# Altium project PicoPrint.PrjPCB (part 2 of 2)

## Sheet PicoPrint-Main.SchDoc
size A2; DocumentNumber: 5; SheetNumber: 5; SheetTotal: 5; PageSetup: Record=PageOptions|CenterHorizontal=True|CenterVertical=True|PrintScale=0.68|XCorrection=1.00|YCorrection=1.00|PrintKind=1|BorderSize=5000000|LeftOffset=0|BottomOffset=0|Orientation=2|PaperLength=1000|PaperWidth=1000|Scale=100|PaperSource=7|PrintQuality=-4|MediaType=1|DitherType=10|PrintScaleMode=1|PaperKind=A3
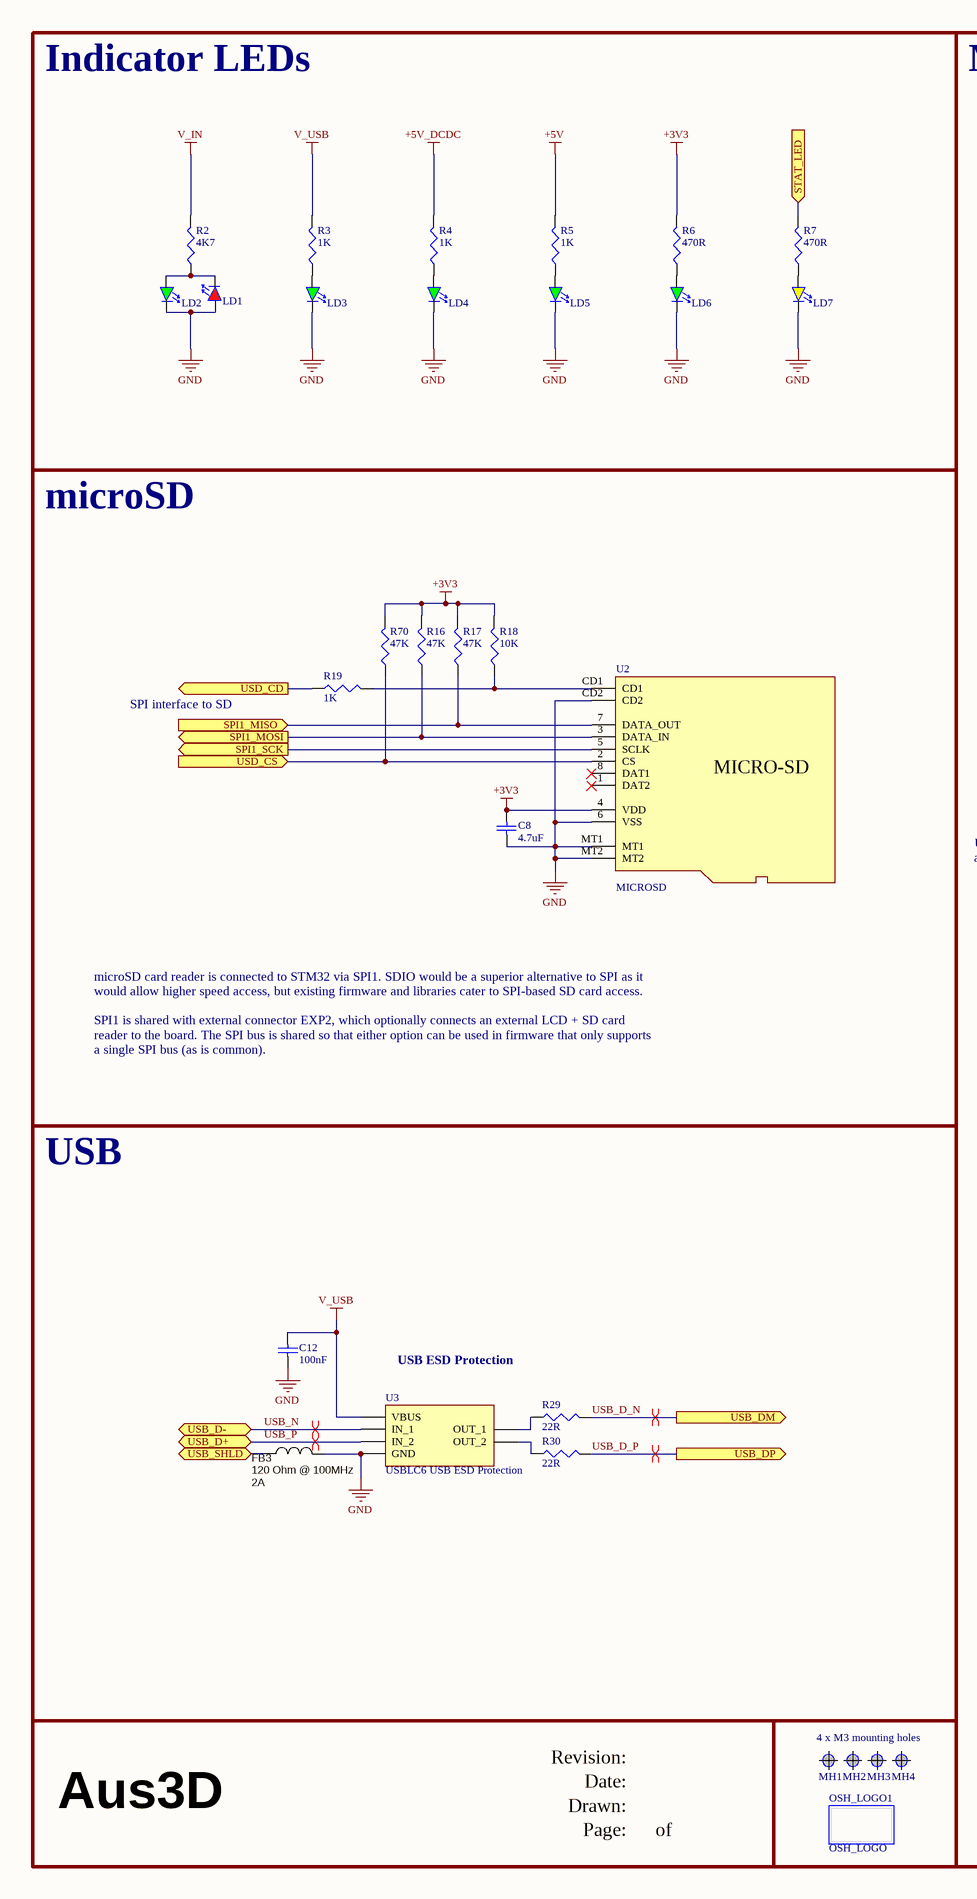
[diagram p5: PicoPrint-Main.SchDoc, left]
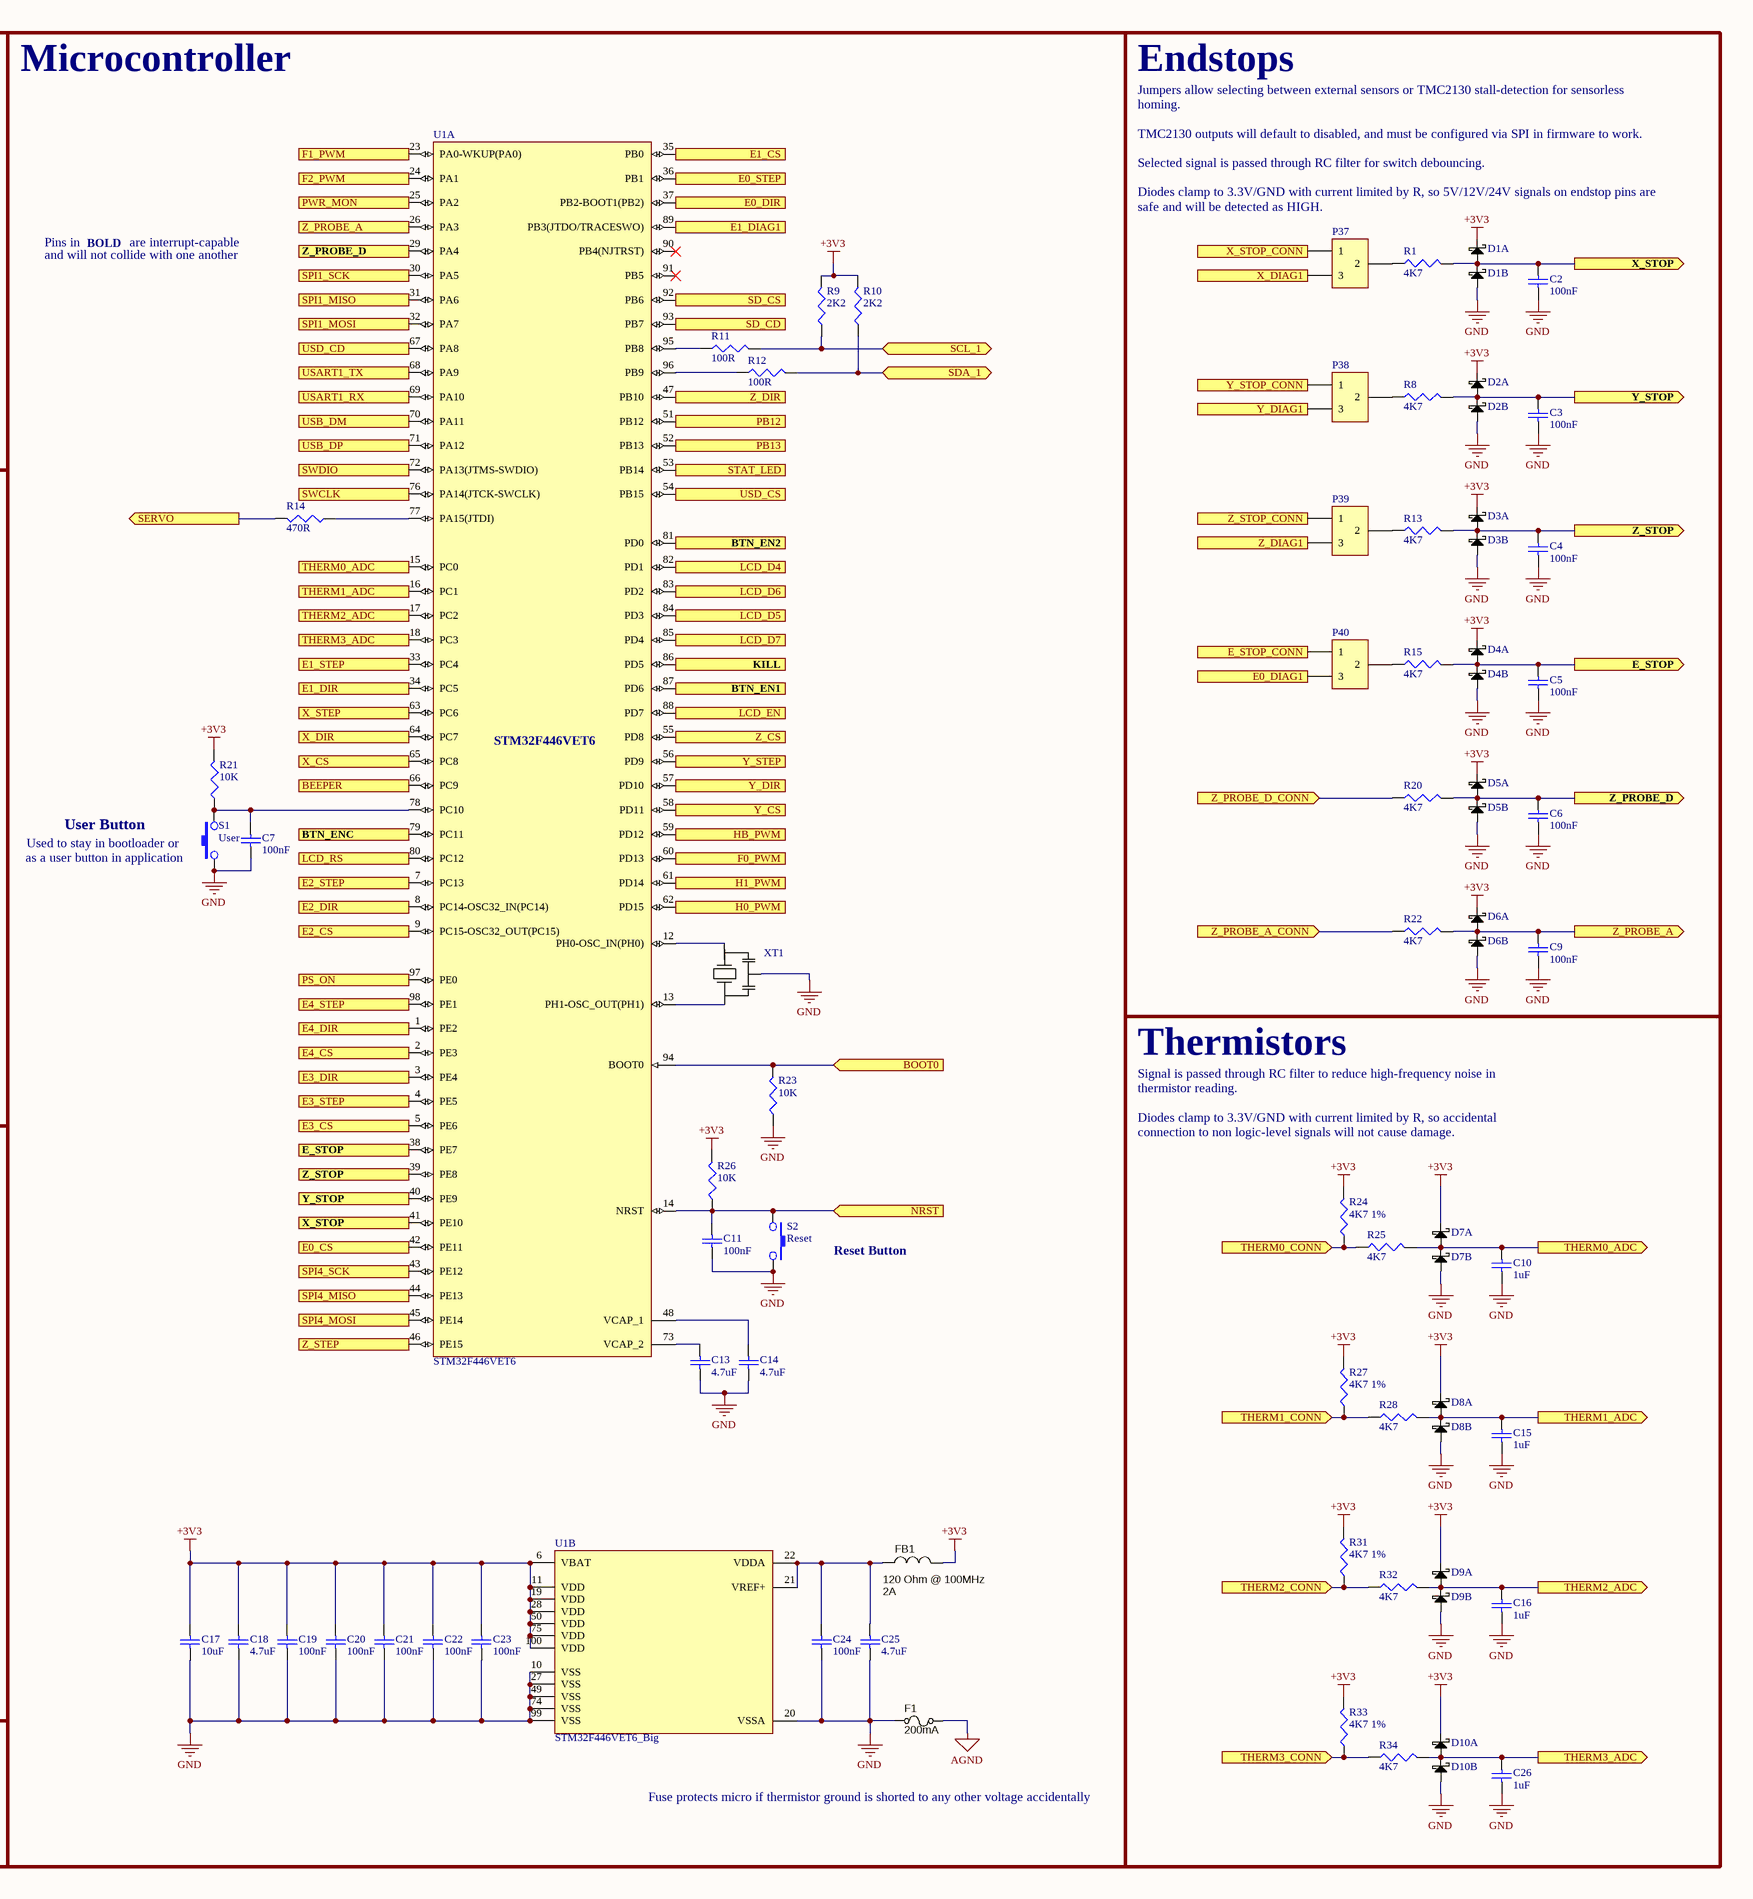
[diagram p6: PicoPrint-Main.SchDoc, right]

### Parts
C2  value 100nF  [CAP 1005-0402]  (hidden comment: CapC-0402-100nF)
C3  value 100nF  [CAP 1005-0402]  (hidden comment: CapC-0402-100nF)
C4  value 100nF  [CAP 1005-0402]  (hidden comment: CapC-0402-100nF)
C5  value 100nF  [CAP 1005-0402]  (hidden comment: CapC-0402-100nF)
C6  value 100nF  [CAP 1005-0402]  (hidden comment: CapC-0402-100nF)
C7  value 100nF  [CAP 1005-0402]  (hidden comment: CapC-0402-100nF)
C8  value 4.7uF  [CAP 1005-0402]  (hidden comment: CapC-0402-4.7uF-10V)
C9  value 100nF  [CAP 1005-0402]  (hidden comment: CapC-0402-100nF)
C10  value 1uF  [CAP 1005-0402]  (hidden comment: CapC-0402-1uF-10V)
C11  value 100nF  [CAP 1005-0402]  (hidden comment: CapC-0402-100nF)
C12  value 100nF  [CAP 1005-0402]  (hidden comment: CapC-0402-100nF)
C13  value 4.7uF  [CAP 1005-0402]  (hidden comment: CapC-0402-4.7uF-10V)
C14  value 4.7uF  [CAP 1005-0402]  (hidden comment: CapC-0402-4.7uF-10V)
C15  value 1uF  [CAP 1005-0402]  (hidden comment: CapC-0402-1uF-10V)
C16  value 1uF  [CAP 1005-0402]  (hidden comment: CapC-0402-1uF-10V)
C17  value 10uF  [CAPC2012X135N]  (hidden comment: CapC-0805-10uF 6.3V)
C18  value 4.7uF  [CAP 1005-0402]  (hidden comment: CapC-0402-4.7uF-10V)
C19  value 100nF  [CAP 1005-0402]  (hidden comment: CapC-0402-100nF)
C20  value 100nF  [CAP 1005-0402]  (hidden comment: CapC-0402-100nF)
C21  value 100nF  [CAP 1005-0402]  (hidden comment: CapC-0402-100nF)
C22  value 100nF  [CAP 1005-0402]  (hidden comment: CapC-0402-100nF)
C23  value 100nF  [CAP 1005-0402]  (hidden comment: CapC-0402-100nF)
C24  value 100nF  [CAP 1005-0402]  (hidden comment: CapC-0402-100nF)
C25  value 4.7uF  [CAP 1005-0402]  (hidden comment: CapC-0402-4.7uF-10V)
C26  value 1uF  [CAP 1005-0402]  (hidden comment: CapC-0402-1uF-10V)
D1  Dual Schottky 100mA 30V SOT523  [SOT523]  (value not drawn)  (parts A,B of 2)
D2  Dual Schottky 100mA 30V SOT523  [SOT523]  (value not drawn)  (parts A,B of 2)
D3  Dual Schottky 100mA 30V SOT523  [SOT523]  (value not drawn)  (parts A,B of 2)
D4  Dual Schottky 100mA 30V SOT523  [SOT523]  (value not drawn)  (parts A,B of 2)
D5  Dual Schottky 100mA 30V SOT523  [SOT523]  (value not drawn)  (parts A,B of 2)
D6  Dual Schottky 100mA 30V SOT523  [SOT523]  (value not drawn)  (parts A,B of 2)
D7  Dual Schottky 100mA 30V SOT523  [SOT523]  (value not drawn)  (parts A,B of 2)
D8  Dual Schottky 100mA 30V SOT523  [SOT523]  (value not drawn)  (parts A,B of 2)
D9  Dual Schottky 100mA 30V SOT523  [SOT523]  (value not drawn)  (parts A,B of 2)
D10  Dual Schottky 100mA 30V SOT523  [SOT523]  (value not drawn)  (parts A,B of 2)
F1  value 200mA  [RES 3216-1206]  (hidden comment: PTC Resettable Fuse)
FB1  Impedance @ Frequency: 120 Ohm @ 100MHz  Current Rating: 2A  [INDC1608N]  (hidden comment: 120R @ 100 MHz)
FB3  Impedance @ Frequency: 120 Ohm @ 100MHz  Current Rating: 2A  [INDC1608N]  (hidden comment: 120R @ 100 MHz)
LD1  LED-0402  [LED 0402]  (value not drawn)
LD2  LED-0402  [LED 0402]  (value not drawn)
LD3  LED-0402  [LED 0402]  (value not drawn)
LD4  LED-0402  [LED 0402]  (value not drawn)
LD5  LED-0402  [LED 0402]  (value not drawn)
LD6  LED-0402  [LED 0402]  (value not drawn)
LD7  LED-0402  [LED 0402]  (value not drawn)
MH1  Screw Hole  [M3-Hole-2]  (value not drawn)  (no BOM)
MH2  Screw Hole  [M3-Hole-2]  (value not drawn)  (no BOM)
MH3  Screw Hole  [M3-Hole-2]  (value not drawn)  (no BOM)
MH4  Screw Hole  [M3-Hole-2]  (value not drawn)  (no BOM)
OSH_LOGO1  OSH_LOGO  [OSHW-LOGO-L]  (no BOM)
P37  X_STOP_SEL  [HDR1X3-HEADER]  (value not drawn)
P38  Y_STOP_SEL  [HDR1X3-HEADER]  (value not drawn)
P39  Z_STOP_SEL  [HDR1X3-HEADER]  (value not drawn)
P40  E_STOP_SEL  [HDR1X3-HEADER]  (value not drawn)
R1  value 4K7  [RESC1005X40N]  (hidden comment: Res-0402-4K7)
R2  value 4K7  [RESC1005X40N]  (hidden comment: Res-0402-4K7)
R3  value 1K  [RESC1005X40N]  (hidden comment: Res-0402-1K)
R4  value 1K  [RESC1005X40N]  (hidden comment: Res-0402-1K)
R5  value 1K  [RESC1005X40N]  (hidden comment: Res-0402-1K)
R6  value 470R  [RESC1005X40N]  (hidden comment: Res-0402-470R)
R7  value 470R  [RESC1005X40N]  (hidden comment: Res-0402-470R)
R8  value 4K7  [RESC1005X40N]  (hidden comment: Res-0402-4K7)
R9  value 2K2  [RESC1005X40N]  (hidden comment: Res-0402-2K2)
R10  value 2K2  [RESC1005X40N]  (hidden comment: Res-0402-2K2)
R11  value 100R  [RESC1005X40N]  (hidden comment: Res-0402-100R)
R12  value 100R  [RESC1005X40N]  (hidden comment: Res-0402-100R)
R13  value 4K7  [RESC1005X40N]  (hidden comment: Res-0402-4K7)
R14  value 470R  [RESC1005X40N]  (hidden comment: Res-0402-470R)
R15  value 4K7  [RESC1005X40N]  (hidden comment: Res-0402-4K7)
R16  value 47K  [RESC1005X40N]  (hidden comment: Res-0402-47K)
R17  value 47K  [RESC1005X40N]  (hidden comment: Res-0402-47K)
R18  value 10K  [RESC1005X40N]  (hidden comment: Res-0402-10K)
R19  value 1K  [RESC1005X40N]  (hidden comment: Res-0402-1K)
R20  value 4K7  [RESC1005X40N]  (hidden comment: Res-0402-4K7)
R21  value 10K  [RESC1005X40N]  (hidden comment: Res-0402-10K)
R22  value 4K7  [RESC1005X40N]  (hidden comment: Res-0402-4K7)
R23  value 10K  [RESC1005X40N]  (hidden comment: Res-0402-10K)
R24  value 4K7 1%  [RESC1005X40N]  (hidden comment: Res-0402-4K7)
R25  value 4K7  [RESC1005X40N]  (hidden comment: Res-0402-4K7)
R26  value 10K  [RESC1005X40N]  (hidden comment: Res-0402-10K)
R27  value 4K7 1%  [RESC1005X40N]  (hidden comment: Res-0402-4K7)
R28  value 4K7  [RESC1005X40N]  (hidden comment: Res-0402-4K7)
R29  value 22R  [RESC1005X40N]  (hidden comment: Res-0402-22R)
R30  value 22R  [RESC1005X40N]  (hidden comment: Res-0402-22R)
R31  value 4K7 1%  [RESC1005X40N]  (hidden comment: Res-0402-4K7)
R32  value 4K7  [RESC1005X40N]  (hidden comment: Res-0402-4K7)
R33  value 4K7 1%  [RESC1005X40N]  (hidden comment: Res-0402-4K7)
R34  value 4K7  [RESC1005X40N]  (hidden comment: Res-0402-4K7)
R70  value 47K  [RESC1005X40N]  (hidden comment: Res-0402-47K)
S1  User  [SW-PB SMD 2pin]
S2  Reset  [SW-PB SMD 2pin]
U1  STM32F446VET6  [STM-LQFP100_N]  (parts A,B of 2)
U2  MICROSD  [MICRO-SD]
U3  USBLC6 USB ESD Protection  [SOT23-6N]
XT1  Ceramic Resonator CSTCE12M0G55-R0  [CERALOCK CSTCE_G]  (value not drawn)

### Blocks framed on the sheet
Indicator LEDs: LD1-LD7 R2-R7
Microcontroller: C7 C11 C13 C14 C17-C25 F1 FB1 R9-R12 R14 R21 R23 R26 S1 S2 U1 XT1
Endstops: C2-C6 C9 D1-D6 P37-P40 R1 R8 R13 R15 R20 R22
microSD: C8 R16-R19 R70 U2
Thermistors: C10 C15 C16 C26 D7-D10 R24 R25 R27 R28 R31-R34
USB: C12 FB3 R29 R30 U3

### Ports
BEEPER (in), BOOT0 (in), BTN_EN1 (in), BTN_EN2 (in), BTN_ENC (in), E0_CS (out), E0_DIAG1 (in), E0_DIR (out), E0_STEP (out), E1_CS (out), E1_DIAG1 (in), E1_DIR (in), E1_STEP (in), E2_CS (in), E2_DIR (in), E2_STEP (in), E3_CS (out), E3_DIR (out), E3_STEP (out), E4_CS (out), E4_DIR (out), E4_STEP (out), E_STOP (in), E_STOP (out), E_STOP_CONN (in), F0_PWM (out), F1_PWM (in), F2_PWM (in), H0_PWM (out), H1_PWM (out), HB_PWM (out), KILL (in), LCD_D4 (out), LCD_D5 (out), LCD_D6 (out), LCD_D7 (out), LCD_EN (out), LCD_RS (in), NRST (in), PB12 (in), PB13 (in), PS_ON (out), PWR_MON (in), SCL_1 (bidir), SD_CD (in), SD_CS (in), SDA_1 (bidir), SERVO (out), SPI1_MISO (in), SPI1_MOSI (out), SPI1_SCK (out), SPI4_MISO (in), SPI4_MOSI (out), SPI4_SCK (out), STAT_LED (in), STAT_LED (out), SWCLK (out), SWDIO (out), THERM0_ADC (in), THERM0_ADC (out), THERM0_CONN (in), THERM1_ADC (in), THERM1_ADC (out), THERM1_CONN (in), THERM2_ADC (in), THERM2_ADC (out), THERM2_CONN (in), THERM3_ADC (in), THERM3_ADC (out), THERM3_CONN (in), USART1_RX (in), USART1_TX (out), USB_D+ (bidir), USB_D- (bidir), USB_DM (out), USB_DP (out), USB_SHLD (bidir), USD_CD (in), USD_CD (out), USD_CS (in), USD_CS (out), X_CS (in), X_DIAG1 (in), X_DIR (in), X_STEP (in), X_STOP (in), X_STOP (out), X_STOP_CONN (in), Y_CS (out), Y_DIAG1 (in), Y_DIR (out), Y_STEP (out), Y_STOP (in), Y_STOP (out), Y_STOP_CONN (in), Z_CS (out), Z_DIAG1 (in), Z_DIR (in), Z_PROBE_A (in), Z_PROBE_A (out), Z_PROBE_A_CONN (in), Z_PROBE_D (in), Z_PROBE_D (out), Z_PROBE_D_CONN (in), Z_STEP (out), Z_STOP (in), Z_STOP (out), Z_STOP_CONN (in)

### Nets
+3V3: C8.2 C17.2 C18.2 C19.2 C20.2 C21.2 C22.2 C23.2 D1.2(K) D2.2(K) D3.2(K) D4.2(K) D5.2(K) D6.2(K) D7.2(K) D8.2(K) D9.2(K) D10.2(K) FB1.2 R6.2 R9.2 R10.2 R16.2 R17.2 R18.2 R21.2 R24.2 R26.2 R27.2 R31.2 R33.2 R70.2 U1.6(VBAT) U1.11(VDD) U1.19(VDD) U1.28(VDD) U1.50(VDD) U1.75(VDD) U1.100(VDD) U2.4(VDD)
+5V: R5.2
+5V_DCDC: R4.2
AGND: F1.2
GND: C2.1 C3.1 C4.1 C5.1 C6.1 C7.1 C8.1 C9.1 C10.1 C11.1 C12.1 C13.1 C14.1 C15.1 C16.1 C17.1 C18.1 C19.1 C20.1 C21.1 C22.1 C23.1 C24.1 C25.1 C26.1 D1.1(A) D2.1(A) D3.1(A) D4.1(A) D5.1(A) D6.1(A) D7.1(A) D8.1(A) D9.1(A) D10.1(A) F1.1 FB3.2 LD1.1(A) LD2.2(K) LD3.2(K) LD4.2(K) LD5.2(K) LD6.2(K) LD7.2(K) R23.1 S1.2 S2.2 U1.10(VSS) U1.20(VSSA) U1.27(VSS) U1.49(VSS) U1.74(VSS) U1.99(VSS) U2.6(VSS) U2.CD2 U2.MT1 U2.MT2 U3.2(GND) XT1.2(GND)
V_IN: R2.2
V_USB: C12.2 R3.2 U3.5(VBUS)
BEEPER: U1.66(PC9) ; port BEEPER
BOOT0: R23.2 U1.94(BOOT0) ; port BOOT0
BTN_EN1: U1.87(PD6) ; port BTN_EN1
BTN_EN2: U1.81(PD0) ; port BTN_EN2
BTN_ENC: U1.79(PC11) ; port BTN_ENC
E0_CS: U1.42(PE11) ; port E0_CS
E0_DIAG1: P40.3 ; port E0_DIAG1
E0_DIR: U1.37(PB2-BOOT1(PB2)) ; port E0_DIR
E0_STEP: U1.36(PB1) ; port E0_STEP
E1_CS: U1.35(PB0) ; port E1_CS
E1_DIAG1: U1.89(PB3(JTDO/TRACESWO)) ; port E1_DIAG1
E1_DIR: U1.34(PC5) ; port E1_DIR
E1_STEP: U1.33(PC4) ; port E1_STEP
E2_CS: U1.9(PC15-OSC32_OUT(PC15)) ; port E2_CS
E2_DIR: U1.8(PC14-OSC32_IN(PC14)) ; port E2_DIR
E2_STEP: U1.7(PC13) ; port E2_STEP
E3_CS: U1.5(PE6) ; port E3_CS
E3_DIR: U1.3(PE4) ; port E3_DIR
E3_STEP: U1.4(PE5) ; port E3_STEP
E4_CS: U1.2(PE3) ; port E4_CS
E4_DIR: U1.1(PE2) ; port E4_DIR
E4_STEP: U1.98(PE1) ; port E4_STEP
E_STOP: C5.2 D4.3(A) R15.2 U1.38(PE7) ; port E_STOP
E_STOP_CONN: P40.1 ; port E_STOP_CONN
F0_PWM: U1.60(PD13) ; port F0_PWM
F1_PWM: U1.23(PA0-WKUP(PA0)) ; port F1_PWM
F2_PWM: U1.24(PA1) ; port F2_PWM
H0_PWM: U1.62(PD15) ; port H0_PWM
H1_PWM: U1.61(PD14) ; port H1_PWM
HB_PWM: U1.59(PD12) ; port HB_PWM
KILL: U1.86(PD5) ; port KILL
LCD_D4: U1.82(PD1) ; port LCD_D4
LCD_D5: U1.84(PD3) ; port LCD_D5
LCD_D6: U1.83(PD2) ; port LCD_D6
LCD_D7: U1.85(PD4) ; port LCD_D7
LCD_EN: U1.88(PD7) ; port LCD_EN
LCD_RS: U1.80(PC12) ; port LCD_RS
NRST: C11.2 R26.1 S2.1 U1.14(NRST) ; port NRST
PB12: U1.51(PB12) ; port PB12
PB13: U1.52(PB13) ; port PB13
PS_ON: U1.97(PE0) ; port PS_ON
PWR_MON: U1.25(PA2) ; port PWR_MON
SCL_1: R9.1 R11.2 ; port SCL_1
SD_CD: U1.93(PB7) ; port SD_CD
SD_CS: U1.92(PB6) ; port SD_CS
SDA_1: R10.1 R12.2 ; port SDA_1
SERVO: R14.2 ; port SERVO
SPI1_MISO: R17.1 U1.31(PA6) U2.7(DATA_OUT) ; port SPI1_MISO
SPI1_MOSI: R16.1 U1.32(PA7) U2.3(DATA_IN) ; port SPI1_MOSI
SPI1_SCK: U1.30(PA5) U2.5(SCLK) ; port SPI1_SCK
SPI4_MISO: U1.44(PE13) ; port SPI4_MISO
SPI4_MOSI: U1.45(PE14) ; port SPI4_MOSI
SPI4_SCK: U1.43(PE12) ; port SPI4_SCK
STAT_LED: R7.2 U1.53(PB14) ; port STAT_LED
SWCLK: U1.76(PA14(JTCK-SWCLK)) ; port SWCLK
SWDIO: U1.72(PA13(JTMS-SWDIO)) ; port SWDIO
THERM0_ADC: C10.2 D7.3(A) R25.2 U1.15(PC0) ; port THERM0_ADC
THERM0_CONN: R24.1 R25.1 ; port THERM0_CONN
THERM1_ADC: C15.2 D8.3(A) R28.2 U1.16(PC1) ; port THERM1_ADC
THERM1_CONN: R27.1 R28.1 ; port THERM1_CONN
THERM2_ADC: C16.2 D9.3(A) R32.2 U1.17(PC2) ; port THERM2_ADC
THERM2_CONN: R31.1 R32.1 ; port THERM2_CONN
THERM3_ADC: C26.2 D10.3(A) R34.2 U1.18(PC3) ; port THERM3_ADC
THERM3_CONN: R33.1 R34.1 ; port THERM3_CONN
USART1_RX: U1.69(PA10) ; port USART1_RX
USART1_TX: U1.68(PA9) ; port USART1_TX
USB_D_N: R29.2 U1.70(PA11) ; port USB_DM
USB_D_P: R30.2 U1.71(PA12) ; port USB_DP
USB_N: U3.1(IN_1) ; port USB_D-
USB_P: U3.3(IN_2) ; port USB_D+
USB_SHLD: FB3.1 ; port USB_SHLD
USD_CD: R19.1 U1.67(PA8) ; port USD_CD
USD_CS: R70.1 U1.54(PB15) U2.2(CS) ; port USD_CS
X_CS: U1.65(PC8) ; port X_CS
X_DIAG1: P37.3 ; port X_DIAG1
X_DIR: U1.64(PC7) ; port X_DIR
X_STEP: U1.63(PC6) ; port X_STEP
X_STOP: C2.2 D1.3(A) R1.2 U1.41(PE10) ; port X_STOP
X_STOP_CONN: P37.1 ; port X_STOP_CONN
Y_CS: U1.58(PD11) ; port Y_CS
Y_DIAG1: P38.3 ; port Y_DIAG1
Y_DIR: U1.57(PD10) ; port Y_DIR
Y_STEP: U1.56(PD9) ; port Y_STEP
Y_STOP: C3.2 D2.3(A) R8.2 U1.40(PE9) ; port Y_STOP
Y_STOP_CONN: P38.1 ; port Y_STOP_CONN
Z_CS: U1.55(PD8) ; port Z_CS
Z_DIAG1: P39.3 ; port Z_DIAG1
Z_DIR: U1.47(PB10) ; port Z_DIR
Z_PROBE_A: C9.2 D6.3(A) R22.2 U1.26(PA3) ; port Z_PROBE_A
Z_PROBE_A_CONN: R22.1 ; port Z_PROBE_A_CONN
Z_PROBE_D: C6.2 D5.3(A) R20.2 U1.29(PA4) ; port Z_PROBE_D
Z_PROBE_D_CONN: R20.1 ; port Z_PROBE_D_CONN
Z_STEP: U1.46(PE15) ; port Z_STEP
Z_STOP: C4.2 D3.3(A) R13.2 U1.39(PE8) ; port Z_STOP
Z_STOP_CONN: P39.1 ; port Z_STOP_CONN
NetC7_2: C7.2 R21.1 S1.1 U1.78(PC10)
NetC13_2: C13.2 U1.73(VCAP_2)
NetC14_2: C14.2 U1.48(VCAP_1)
NetC24_2: C24.2 C25.2 FB1.1 U1.21(VREF+) U1.22(VDDA)
NetLD1_2: LD1.2(K) LD2.1(A) R2.1
NetLD3_1: LD3.1(A) R3.1
NetLD4_1: LD4.1(A) R4.1
NetLD5_1: LD5.1(A) R5.1
NetLD6_1: LD6.1(A) R6.1
NetLD7_1: LD7.1(A) R7.1
NetP37_2: P37.2 R1.1
NetP38_2: P38.2 R8.1
NetP39_2: P39.2 R13.1
NetP40_2: P40.2 R15.1
NetR11_1: R11.1 U1.95(PB8)
NetR12_1: R12.1 U1.96(PB9)
NetR14_1: R14.1 U1.77(PA15(JTDI))
NetR18_1: R18.1 R19.2 U2.CD1
NetR29_1: R29.1 U3.6(OUT_1)
NetR30_1: R30.1 U3.4(OUT_2)
NetU1_12: U1.12(PH0-OSC_IN(PH0)) XT1.3(OUT)
NetU1_13: U1.13(PH1-OSC_OUT(PH1)) XT1.1(IN)

Not connected (* = marked no-connect by the designer): MH1 M3(0); MH2 M3(0); MH3 M3(0); MH4 M3(0); U1 90(PB4(NJTRST))* 91(PB5)*; U2 1(DAT2)* 8(DAT1)*

### Layout directives
differential pair: USB_D_N, USB_D_P, USB_N, USB_P

### Notes on the sheet
- Jumpers allow selecting between external sensors or TMC2130 stall-detection for sensorless homing.
  TMC2130 outputs will default to disabled, and must be configured via SPI in firmware to work.
  Selected signal is passed through RC filter for switch debouncing.
  Diodes clamp to 3.3V/GND with current limited by R, so 5V/12V/24V signals on endstop pins are safe and will be detected as HIGH.
- Pins in
- and will not collide with one another
- BOLD
- are interrupt-capable
- SPI interface to SD
- User Button
- (near S1) Used to stay in bootloader or
  as a user button in application
- microSD card reader is connected to STM32 via SPI1. SDIO would be a superior alternative to SPI as it would allow higher speed access, but existing firmware and libraries cater to SPI-based SD card access.
  SPI1 is shared with external connector EXP2, which optionally connects an external LCD + SD card reader to the board. The SPI bus is shared so that either option can be used in firmware that only supports a single SPI bus (as is common).
- Signal is passed through RC filter to reduce high-frequency noise in thermistor reading.
  Diodes clamp to 3.3V/GND with current limited by R, so accidental connection to non logic-level signals will not cause damage.
- Reset Button
- USB ESD Protection
- 4 x M3 mounting holes
- Date:
- Revision:
- Fuse protects micro if thermistor ground is shorted to any other voltage accidentally
- Aus3D
- Drawn:
- Page:
- of
- (in symbol MICROSD) MICRO-SD

### Library data of the parts
C2-C7 C9 C11 C12 C19-C24 = CapC-0402-100nF: Capacitor (SMD Ceramic); Note: Approved sub OK; Published: 8-Jun-2000; Revision: July-2002: Re-released for DXP Platform.; Publisher: Altium Limited; Supplier 1: Digi-Key; Supplier Part Number 1: 311-1336-1-ND
C8 C13 C14 C18 C25 = CapC-0402-4.7uF-10V: Capacitor (SMD Ceramic); Voltage: 10V; Note: Approved sub OK; Published: 8-Jun-2000; Revision: July-2002: Re-released for DXP Platform.; Publisher: Altium Limited; Supplier 1: Digi-Key; Supplier Part Number 1: 1276-1482-1-ND
C10 C15 C16 C26 = CapC-0402-1uF-10V: Capacitor (SMD Ceramic); Voltage: 10V; Note: Approved sub OK; Published: 8-Jun-2000; Revision: July-2002: Re-released for DXP Platform.; Publisher: Altium Limited; Supplier 1: Digi-Key; Supplier Part Number 1: 1276-1448-1-ND
C17 = CapC-0805-10uF 6.3V: Capacitor (SMD Ceramic); Note: Approved sub OK; Published: 8-Jun-2000; Revision: July-2002: Re-released for DXP Platform.; Publisher: Altium Limited; Supplier 1: Digi-Key; Supplier Part Number 1: 1276-6457-1-ND
D1-D10 = Diode Schottky BAT54ST: Diode (SMD); Note: Approved sub OK; Revision: July-2002: Re-released for DXP Platform.; Supplier 1: Digi-Key; Supplier Part Number 1: BAT54ST-TPCT-ND
F1 = Fuse - 30V 400mA Trip PTC SMD 1206: Note: Approved sub OK; Package / Case: 1206 (3216 metric); Supplier 1: Digi-Key; Supplier Part Number 1: 507-1797-1-ND
FB1 = FERRITE_120R-100MHz_0603: Ferrite bead 120 Ohm at 100 MHz 2A 0603 SMD; Manufacturer 1: Murata Electronics North America; Manufacturer Part Number 1: BLM18PG121SN1D; Current: 900mA; DC Resistance (DCR): 172.9 mOhm Max; Frequency - Self Resonant: 23MHz; Frequency - Test: 100kHz; Filter Type: Differential Mode - Single; Number of Lines: 1; Ratings: 2 A; 50 mO DC; SCDType: source; Note: Approved sub OK; Current - Saturation: 900mA; Current - Temperature Rise: 900mA; Applications: Power Supplies; Package / Case: 1210 (3225 Metric); Operating Temperature: -40°C ~ 105°C; ComponentLink1URL: http://www.yuden.co.jp/ut/product/pdf/wound02_e.pdf; ComponentLink1Description: http://www.yuden.co.jp/ut/product/pdf/wound02_e.pdf; Supplier 1: Digi-Key; Supplier Part Number 1: 490-1037-1-ND; Mounting Type: Surface Mount; Height (Max): 0.037" (0.95mm); Size / Dimension: 0.063" L x 0.031" W (1.60mm x 0.80mm); ComponentLink2URL: http://search.murata.co.jp/Ceramy/image/img/PDF/ENG/L0110S0100BLM18P.pdf; ComponentLink2Description: http://search.murata.co.jp/Ceramy/image/img/PDF/ENG/L0110S0100BLM18P.pdf; Value: 120R @ 100 MHz
FB3 = FERRITE_120R-100MHz_0603: Ferrite bead 120 Ohm at 100 MHz 2A 0603 SMD; Manufacturer 1: Murata Electronics North America; Manufacturer Part Number 1: BLM18PG121SN1D; Current: 900mA; DC Resistance (DCR): 172.9 mOhm Max; Frequency - Self Resonant: 23MHz; Frequency - Test: 100kHz; Filter Type: Differential Mode - Single; Number of Lines: 1; Ratings: 2 A; 50 mO DC; SCDType: source; Current - Saturation: 900mA; Current - Temperature Rise: 900mA; Applications: Power Supplies; Package / Case: 1210 (3225 Metric); Operating Temperature: -40°C ~ 105°C; ComponentLink1URL: http://www.yuden.co.jp/ut/product/pdf/wound02_e.pdf; ComponentLink1Description: http://www.yuden.co.jp/ut/product/pdf/wound02_e.pdf; Supplier 1: Digi-Key; Supplier Part Number 1: 490-1037-1-ND; Mounting Type: Surface Mount; Height (Max): 0.037" (0.95mm); Size / Dimension: 0.063" L x 0.031" W (1.60mm x 0.80mm); ComponentLink2URL: http://search.murata.co.jp/Ceramy/image/img/PDF/ENG/L0110S0100BLM18P.pdf; ComponentLink2Description: http://search.murata.co.jp/Ceramy/image/img/PDF/ENG/L0110S0100BLM18P.pdf; Value: 120R @ 100 MHz
LD1 = LEDR  0402: LED (SMD); Note: Approved sub OK; Value: Red; Supplier 1: Digi-Key; Supplier Part Number 1: 732-11991-1-ND
LD2-LD6 = LEDG  0402: LED (SMD); Note: Approved sub OK; Value: Green; Supplier 1: Digi-Key; Supplier Part Number 1: 732-11992-1-ND
LD7 = LEDY  0402: LED (SMD); Note: Approved sub OK; Value: Yellow; Supplier 1: Digi-Key; Supplier Part Number 1: 732-11993-1-ND
P37-P40 = Header 3: Header, 3-Pin; Manufacturer 1: Generic Header; Note: Approved sub OK; LatestRevisionDate: 17-Jul-2002; LatestRevisionNote: Re-released for DXP Platform.; Publisher: Altium Limited
R1 R2 R8 R13 R15 R20 R22 R24 R25 R27 R28 R31-R34 = Res-0402-4K7: Resistor; Note: Approved sub OK; Published: 8-Jun-2000; Revision: July-2002: Re-released for DXP Platform.; Publisher: Altium Limited; Supplier 1: Digi-Key; Supplier Part Number 1: 311-4.7KJRCT-ND
R3-R5 R19 = Res-0402-1K: Resistor; Note: Approved sub OK; Published: 8-Jun-2000; Revision: July-2002: Re-released for DXP Platform.; Publisher: Altium Limited; Supplier 1: Digi-Key; Supplier Part Number 1: 311-1.0KJRCT-ND
R6 R7 R14 = Res-0402-470R: Resistor; Note: Approved sub OK; Published: 8-Jun-2000; Revision: July-2002: Re-released for DXP Platform.; Publisher: Altium Limited; Supplier 1: Digi-Key; Supplier Part Number 1: 311-470JRCT-ND
R9 R10 = Res-0402-2K2: Resistor; Note: Approved sub OK; Published: 8-Jun-2000; Revision: July-2002: Re-released for DXP Platform.; Publisher: Altium Limited; Supplier 1: Digi-Key; Supplier Part Number 1: 311-2.2KJRCT-ND
R11 R12 = Res-0402-100R: Resistor; Note: Approved sub OK; Published: 8-Jun-2000; Revision: July-2002: Re-released for DXP Platform.; Publisher: Altium Limited; Supplier 1: Digi-Key; Supplier Part Number 1: 311-100JRCT-ND
R16 R17 R70 = Res-0402-47K: Resistor; Note: Approved sub OK; Published: 8-Jun-2000; Revision: July-2002: Re-released for DXP Platform.; Publisher: Altium Limited; Supplier 1: Digi-Key; Supplier Part Number 1: 311-47KJRCT-ND
R18 R21 R23 R26 = Res-0402-10K: Resistor; Note: Approved sub OK; Published: 8-Jun-2000; Revision: July-2002: Re-released for DXP Platform.; Publisher: Altium Limited; Supplier 1: Digi-Key; Supplier Part Number 1: 311-10KJRCT-ND
R29 R30 = Res-0402-22R: Resistor; Note: Approved sub OK; Published: 8-Jun-2000; Revision: July-2002: Re-released for DXP Platform.; Publisher: Altium Limited; Supplier 1: Digi-Key; Supplier Part Number 1: 311-22JRCT-ND
S1 S2 = SW-PB: SMD Button; Note: Approved sub OK; Supplier 1: Digi-Key; Supplier Part Number 1: 679-2396-1-ND
U1 = STM32F446VET6_Big: ARM Cortex-M4 32-bit MCU+FPU, 210 DMIPS, 512 kB Flash, 128 kB Internal RAM, 81 I/Os, 100-pin LQFP, -40 to 105 degC, Tray; Manufacturer: STMicroelectronics; PartNumber: STM32F407VGT7; D/A Converter: 2x12-bit; FLASH Size (Prog) (kB): 1024; I/Os (High Current): 82; Internal RAM Size (kB): 192; Operating Frequency(F) (Processor speed) (MHz): 168; Supply Voltage(Vcc) max (V): 3.6; Supply Voltage(Vcc) min (V): 1.8; DatasheetVersion: Rev. 4; PackageVersion: Rev. 1, 06/2013; PackageReference: LQFP100; PackageDescription: 100-Pin Low Profile Quad Flat Package, 14 x 14 mm Body, 0.5 mm Pitch; Core: ARM Cortex-M4; Packing: Tray; Mounting Technology: Surface Mount; ComponentLink1Description: Manufacturer URL; ComponentLink1URL: http://www.st.com/web/en/home.html; ComponentLink2Description: Datasheet; ComponentLink2URL: http://www.st.com/st-web-ui/static/active/en/resource/technical/document/datasheet/DM00037051.pdf; ComponentLink3Description: Package Specification; ComponentLink3URL: http://www.st.com/st-web-ui/static/active/en/resource/technical/document/data_brief/DM00071938.pdf; Supplier 1: Digi-Key; Supplier Part Number 1: 497-15375-ND
U2 = MICROSD: MicroSD Card Socket; Note: Approved sub OK; Supplier 1: Digi-Key; Supplier Part Number 1: 101-00660-68-6-1-ND
U3 = USBLC6 USB ESD Protection: ESD Protection IC; Supplier 1: Digi-Key; Supplier Part Number 1: 497-5235-1-ND
XT1 = Ceramic Resonator CSTCE12M0G55-R0: Ceramic Resonator; Note: Approved sub OK; Supplier 1: Digi-Key; Supplier Part Number 1: 490-1197-1-ND

## Nets that join several sheets
+3V3: PicoPrint-Connectors (J2.1 P7.5 P18.13), PicoPrint-Power (C116.1 C123.2 J8.1 U11.5), PicoPrint-Motors (10 pins), PicoPrint-Main (40 pins)
+5V: PicoPrint-Connectors (11 pins), PicoPrint-Power (6 pins), PicoPrint-MOSFETs (C27.1 U4.1), PicoPrint-Motors (10 pins), PicoPrint-Main (R5.2)
+5V_DCDC: PicoPrint-Power (5 pins), PicoPrint-Main (R4.2)
+ES_VDD: PicoPrint-Connectors (5 pins), PicoPrint-Power (J8.2)
AGND: PicoPrint-Connectors (P14.2 P14.4 P14.6 P14.8), PicoPrint-Main (F1.2)
GND: PicoPrint-Connectors (21 pins), PicoPrint-Power (20 pins), PicoPrint-MOSFETs (21 pins), PicoPrint-Motors (124 pins), PicoPrint-Main (59 pins)
HB_GND: PicoPrint-Connectors (P4.1), PicoPrint-MOSFETs (Q5.3)
V_IN: PicoPrint-Connectors (P1.2), PicoPrint-Power (5 pins), PicoPrint-Main (R2.2)
V_MAIN: PicoPrint-Connectors (11 pins), PicoPrint-Power (9 pins), PicoPrint-MOSFETs (D11.K D12.K D13.K)
V_MOT: PicoPrint-Power (FB2.2), PicoPrint-Motors (44 pins)
V_USB: PicoPrint-Connectors (J1.VBUS), PicoPrint-Power (F3.1), PicoPrint-Main (C12.2 R3.2 U3.5)
BEEPER: PicoPrint-Connectors (P5.1), PicoPrint-Main (U1.66)
BOOT0: PicoPrint-Connectors (P18.11), PicoPrint-Main (R23.2 U1.94)
BTN_EN1: PicoPrint-Connectors (P10.5), PicoPrint-Main (U1.87)
BTN_EN2: PicoPrint-Connectors (P10.3), PicoPrint-Main (U1.81)
BTN_ENC: PicoPrint-Connectors (P5.2), PicoPrint-Main (U1.79)
E0_CS: PicoPrint-Connectors (P34.3), PicoPrint-Motors (U8.2), PicoPrint-Main (U1.42)
E0_DIAG1: PicoPrint-Motors (U8.21), PicoPrint-Main (P40.3)
E0_DIR: PicoPrint-Connectors (P34.1), PicoPrint-Motors (U8.7), PicoPrint-Main (U1.37)
E0_MOT_1A: PicoPrint-Connectors (P33.3 P33.4), PicoPrint-Motors (C98.2 U8.32)
E0_MOT_1B: PicoPrint-Connectors (P33.1 P33.2), PicoPrint-Motors (C97.2 U8.34)
E0_MOT_2A: PicoPrint-Connectors (P33.5 P33.6), PicoPrint-Motors (C104.1 U8.13)
E0_MOT_2B: PicoPrint-Connectors (P33.7 P33.8), PicoPrint-Motors (C103.1 U8.15)
E0_STEP: PicoPrint-Connectors (P34.2), PicoPrint-Motors (U8.6), PicoPrint-Main (U1.36)
E1_CS: PicoPrint-Connectors (P36.3), PicoPrint-Motors (U9.2), PicoPrint-Main (U1.35)
E1_DIAG1: PicoPrint-Motors (U9.21), PicoPrint-Main (U1.89)
E1_DIR: PicoPrint-Connectors (P36.1), PicoPrint-Motors (U9.7), PicoPrint-Main (U1.34)
E1_MOT_1A: PicoPrint-Connectors (P35.3 P35.4), PicoPrint-Motors (C100.2 U9.32)
E1_MOT_1B: PicoPrint-Connectors (P35.1 P35.2), PicoPrint-Motors (C99.2 U9.34)
E1_MOT_2A: PicoPrint-Connectors (P35.5 P35.6), PicoPrint-Motors (C106.1 U9.13)
E1_MOT_2B: PicoPrint-Connectors (P35.7 P35.8), PicoPrint-Motors (C105.1 U9.15)
E1_STEP: PicoPrint-Connectors (P36.2), PicoPrint-Motors (U9.6), PicoPrint-Main (U1.33)
E2_CS: PicoPrint-Connectors (P13.8), PicoPrint-Main (U1.9)
E2_DIR: PicoPrint-Connectors (P13.6), PicoPrint-Main (U1.8)
E2_STEP: PicoPrint-Connectors (P13.4), PicoPrint-Main (U1.7)
E3_CS: PicoPrint-Connectors (P13.13), PicoPrint-Main (U1.5)
E3_DIR: PicoPrint-Connectors (P13.11), PicoPrint-Main (U1.3)
E3_STEP: PicoPrint-Connectors (P13.9), PicoPrint-Main (U1.4)
E4_CS: PicoPrint-Connectors (P13.14), PicoPrint-Main (U1.2)
E4_DIR: PicoPrint-Connectors (P13.12), PicoPrint-Main (U1.1)
E4_STEP: PicoPrint-Connectors (P13.10), PicoPrint-Main (U1.98)
E_STOP_CONN: PicoPrint-Connectors (P3.3), PicoPrint-Main (P40.1)
F0_PWM: PicoPrint-MOSFETs (R35.1 R37.2 R39.2), PicoPrint-Main (U1.60)
F1_PWM: PicoPrint-MOSFETs (R42.1 R44.2 R46.2), PicoPrint-Main (U1.23)
F2_PWM: PicoPrint-MOSFETs (R47.1 R48.2 R49.2), PicoPrint-Main (U1.24)
FAN0: PicoPrint-Connectors (P19.2 P22.2), PicoPrint-MOSFETs (D11.A Q1.3)
FAN1: PicoPrint-Connectors (P24.2 P26.2), PicoPrint-MOSFETs (D12.A Q4.3)
FAN2: PicoPrint-Connectors (P32.2), PicoPrint-MOSFETs (D13.A Q8.3)
H0_PWM: PicoPrint-MOSFETs (R36.1 R38.2 R40.2), PicoPrint-Main (U1.62)
H1_PWM: PicoPrint-MOSFETs (R41.1 R43.2 R45.2), PicoPrint-Main (U1.61)
HB_PWM: PicoPrint-MOSFETs (R51.2 R52.2 U4.2), PicoPrint-Main (U1.59)
HEATED_BED: PicoPrint-Connectors (P11.1), PicoPrint-MOSFETs (Q5.2)
HEATER0: PicoPrint-Connectors (P12.2 P15.2), PicoPrint-MOSFETs (Q2.3)
HEATER1: PicoPrint-Connectors (P16.2 P17.2), PicoPrint-MOSFETs (Q3.3)
KILL: PicoPrint-Connectors (P10.8), PicoPrint-Main (U1.86)
LCD_D4: PicoPrint-Connectors (P5.5), PicoPrint-Main (U1.82)
LCD_D5: PicoPrint-Connectors (P5.6), PicoPrint-Main (U1.84)
LCD_D6: PicoPrint-Connectors (P5.7), PicoPrint-Main (U1.83)
LCD_D7: PicoPrint-Connectors (P5.8), PicoPrint-Main (U1.85)
LCD_EN: PicoPrint-Connectors (P5.3), PicoPrint-Main (U1.88)
LCD_RS: PicoPrint-Connectors (P5.4), PicoPrint-Main (U1.80)
NRST: PicoPrint-Connectors (P18.12), PicoPrint-Main (C11.2 R26.1 S2.1 U1.14)
PB12: PicoPrint-Connectors (P13.16), PicoPrint-Main (U1.51)
PB13: PicoPrint-Connectors (P13.15), PicoPrint-Main (U1.52)
PS_ON: PicoPrint-MOSFETs (R53.2 R54.2), PicoPrint-Main (U1.97)
PS_ON_OUT: PicoPrint-Connectors (P28.1), PicoPrint-MOSFETs (Q9.3)
PWR_MON: PicoPrint-Power (C124.2 R65.1 R68.2), PicoPrint-Main (U1.25)
SCL_1: PicoPrint-Connectors (P13.18 P30.4), PicoPrint-Main (R9.1 R11.2)
SD_CD: PicoPrint-Connectors (P10.7), PicoPrint-Main (U1.93)
SD_CS: PicoPrint-Connectors (P10.4), PicoPrint-Main (U1.92)
SDA_1: PicoPrint-Connectors (P13.17 P30.3), PicoPrint-Main (R10.1 R12.2)
SERVO: PicoPrint-Connectors (P29.1), PicoPrint-Main (R14.2)
SPI1_MISO: PicoPrint-Connectors (P10.1), PicoPrint-Main (R17.1 U1.31 U2.7)
SPI1_MOSI: PicoPrint-Connectors (P10.6), PicoPrint-Main (R16.1 U1.32 U2.3)
SPI1_SCK: PicoPrint-Connectors (P10.2), PicoPrint-Main (U1.30 U2.5)
SPI4_MISO: PicoPrint-Connectors (P13.7), PicoPrint-Motors (5 pins), PicoPrint-Main (U1.44)
SPI4_MOSI: PicoPrint-Connectors (P13.5), PicoPrint-Motors (5 pins), PicoPrint-Main (U1.45)
SPI4_SCK: PicoPrint-Connectors (P13.3), PicoPrint-Motors (5 pins), PicoPrint-Main (U1.43)
SWCLK: PicoPrint-Connectors (P18.7), PicoPrint-Main (U1.76)
SWDIO: PicoPrint-Connectors (P18.1), PicoPrint-Main (U1.72)
THERM0_CONN: PicoPrint-Connectors (P14.1), PicoPrint-Main (R24.1 R25.1)
THERM1_CONN: PicoPrint-Connectors (P14.3), PicoPrint-Main (R27.1 R28.1)
THERM2_CONN: PicoPrint-Connectors (P14.5), PicoPrint-Main (R31.1 R32.1)
THERM3_CONN: PicoPrint-Connectors (P14.7), PicoPrint-Main (R33.1 R34.1)
USART1_RX: PicoPrint-Connectors (P18.8), PicoPrint-Main (U1.69)
USART1_TX: PicoPrint-Connectors (P18.10), PicoPrint-Main (U1.68)
USB_N: PicoPrint-Connectors (J1.D-), PicoPrint-Main (U3.1)
USB_P: PicoPrint-Connectors (J1.D+), PicoPrint-Main (U3.3)
USB_SHLD: PicoPrint-Connectors (J1.SHIELD), PicoPrint-Main (FB3.1)
X_CS: PicoPrint-Connectors (P21.3), PicoPrint-Motors (U5.2), PicoPrint-Main (U1.65)
X_DIAG1: PicoPrint-Motors (U5.21), PicoPrint-Main (P37.3)
X_DIR: PicoPrint-Connectors (P21.1), PicoPrint-Motors (U5.7), PicoPrint-Main (U1.64)
X_MOT_1A: PicoPrint-Connectors (P20.3 P20.4), PicoPrint-Motors (C58.2 U5.32)
X_MOT_1B: PicoPrint-Connectors (P20.1 P20.2), PicoPrint-Motors (C57.2 U5.34)
X_MOT_2A: PicoPrint-Connectors (P20.5 P20.6), PicoPrint-Motors (C67.1 U5.13)
X_MOT_2B: PicoPrint-Connectors (P20.7 P20.8), PicoPrint-Motors (C66.1 U5.15)
X_STEP: PicoPrint-Connectors (P21.2), PicoPrint-Motors (U5.6), PicoPrint-Main (U1.63)
X_STOP_CONN: PicoPrint-Connectors (P2.3), PicoPrint-Main (P37.1)
Y_CS: PicoPrint-Connectors (P25.3), PicoPrint-Motors (U6.2), PicoPrint-Main (U1.58)
Y_DIAG1: PicoPrint-Motors (U6.21), PicoPrint-Main (P38.3)
Y_DIR: PicoPrint-Connectors (P25.1), PicoPrint-Motors (U6.7), PicoPrint-Main (U1.57)
Y_MOT_1A: PicoPrint-Connectors (P23.3 P23.4), PicoPrint-Motors (C60.2 U6.32)
Y_MOT_1B: PicoPrint-Connectors (P23.1 P23.2), PicoPrint-Motors (C59.2 U6.34)
Y_MOT_2A: PicoPrint-Connectors (P23.5 P23.6), PicoPrint-Motors (C69.1 U6.13)
Y_MOT_2B: PicoPrint-Connectors (P23.7 P23.8), PicoPrint-Motors (C68.1 U6.15)
Y_STEP: PicoPrint-Connectors (P25.2), PicoPrint-Motors (U6.6), PicoPrint-Main (U1.56)
Y_STOP_CONN: PicoPrint-Connectors (P6.3), PicoPrint-Main (P38.1)
Z_CS: PicoPrint-Connectors (P31.3), PicoPrint-Motors (U7.2), PicoPrint-Main (U1.55)
Z_DIAG1: PicoPrint-Motors (U7.21), PicoPrint-Main (P39.3)
Z_DIR: PicoPrint-Connectors (P31.1), PicoPrint-Motors (U7.7), PicoPrint-Main (U1.47)
Z_MOT_1A: PicoPrint-Connectors (P27.3 P27.4), PicoPrint-Motors (C62.2 U7.32)
Z_MOT_1B: PicoPrint-Connectors (P27.1 P27.2), PicoPrint-Motors (C61.2 U7.34)
Z_MOT_2A: PicoPrint-Connectors (P27.5 P27.6), PicoPrint-Motors (C71.1 U7.13)
Z_MOT_2B: PicoPrint-Connectors (P27.7 P27.8), PicoPrint-Motors (C70.1 U7.15)
Z_PROBE_A_CONN: PicoPrint-Connectors (P8.4), PicoPrint-Main (R22.1)
Z_PROBE_D_CONN: PicoPrint-Connectors (P8.3), PicoPrint-Main (R20.1)
Z_STEP: PicoPrint-Connectors (P31.2), PicoPrint-Motors (U7.6), PicoPrint-Main (U1.46)
Z_STOP_CONN: PicoPrint-Connectors (P9.3), PicoPrint-Main (P39.1)